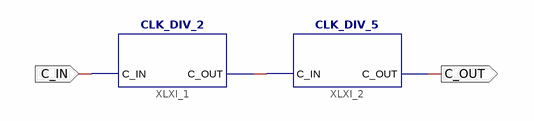
[diagram p0: schematic sheet 1]
// Xilinx ISE schematic DIV_10.sch (spartan6) as structural Verilog: 2 symbols, 2 ports
module DIV_10 (
  input  C_IN,
  output C_OUT
);

  wire XLXN_1;

  CLK_DIV_2 XLXI_1 (.C_IN(C_IN), .C_OUT(XLXN_1));
  CLK_DIV_5 XLXI_2 (.C_IN(XLXN_1), .C_OUT(C_OUT));
endmodule
